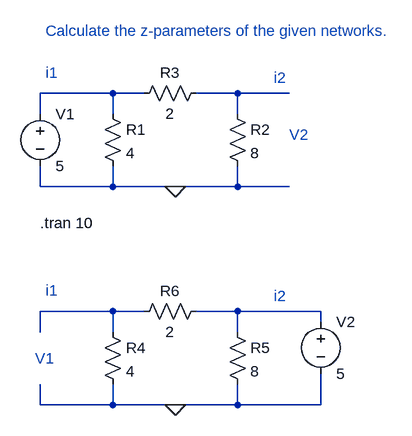
[diagram p0: schematic Lab6_ques2.asc]
Lab6_ques2.asc, the LTspice schematic file:
Version 4
SHEET 1 1132 712
WIRE 112 160 0 160
WIRE 160 160 112 160
WIRE 304 160 240 160
WIRE 384 160 304 160
WIRE 0 192 0 160
WIRE 112 192 112 160
WIRE 304 192 304 160
WIRE 0 304 0 272
WIRE 112 304 112 272
WIRE 112 304 0 304
WIRE 208 304 112 304
WIRE 304 304 304 272
WIRE 304 304 208 304
WIRE 384 304 304 304
WIRE 112 496 0 496
WIRE 160 496 112 496
WIRE 304 496 240 496
WIRE 432 496 304 496
WIRE 432 512 432 496
WIRE 0 528 0 496
WIRE 112 528 112 496
WIRE 304 528 304 496
WIRE 0 640 0 608
WIRE 112 640 112 608
WIRE 112 640 0 640
WIRE 208 640 112 640
WIRE 304 640 304 608
WIRE 304 640 208 640
WIRE 432 640 432 592
WIRE 432 640 304 640
FLAG 208 304 0
FLAG 208 640 0
SYMBOL Res 96 176 R0
SYMATTR InstName R1
SYMATTR Value 4
SYMBOL Res 288 176 R0
SYMATTR InstName R2
SYMATTR Value 8
SYMBOL Res 256 144 R90
WINDOW 0 0 56 VBottom 2
WINDOW 3 32 56 VTop 2
SYMATTR InstName R3
SYMATTR Value 2
SYMBOL Voltage 0 176 R0
SYMATTR InstName V1
SYMATTR Value 5
SYMBOL Res 96 512 R0
SYMATTR InstName R4
SYMATTR Value 4
SYMBOL Res 288 512 R0
SYMATTR InstName R5
SYMATTR Value 8
SYMBOL Res 256 480 R90
WINDOW 0 0 56 VBottom 2
WINDOW 3 32 56 VTop 2
SYMATTR InstName R6
SYMATTR Value 2
SYMBOL Voltage 432 496 R0
SYMATTR InstName V2
SYMATTR Value 5
TEXT 8 64 Left 2 ;Calculate the z-parameters of the given networks.
TEXT 0 360 Left 2 !.tran 10
TEXT 8 128 Left 2 ;i1
TEXT 360 136 Left 2 ;i2
TEXT 384 224 Left 2 ;V2
TEXT 8 464 Left 2 ;i1
TEXT 360 472 Left 2 ;i2
TEXT -8 568 Left 2 ;V1

The netlist it stands for:
* Lab6_ques2.asc
R1 N001 0 4
R2 N002 0 8
R3 N002 N001 2
V1 N001 0 5
R4 N003 0 4
R5 N004 0 8
R6 N004 N003 2
V2 N004 0 5
* Calculate the z-parameters of the given networks.
.tran 10
* i1
* i2
* V2
* i1
* i2
* V1
.backanno
.end